# EAGLE schematic AutoTunerV1 (EAGLE 9.6.2)

## Sheet 1 of 4: mcu
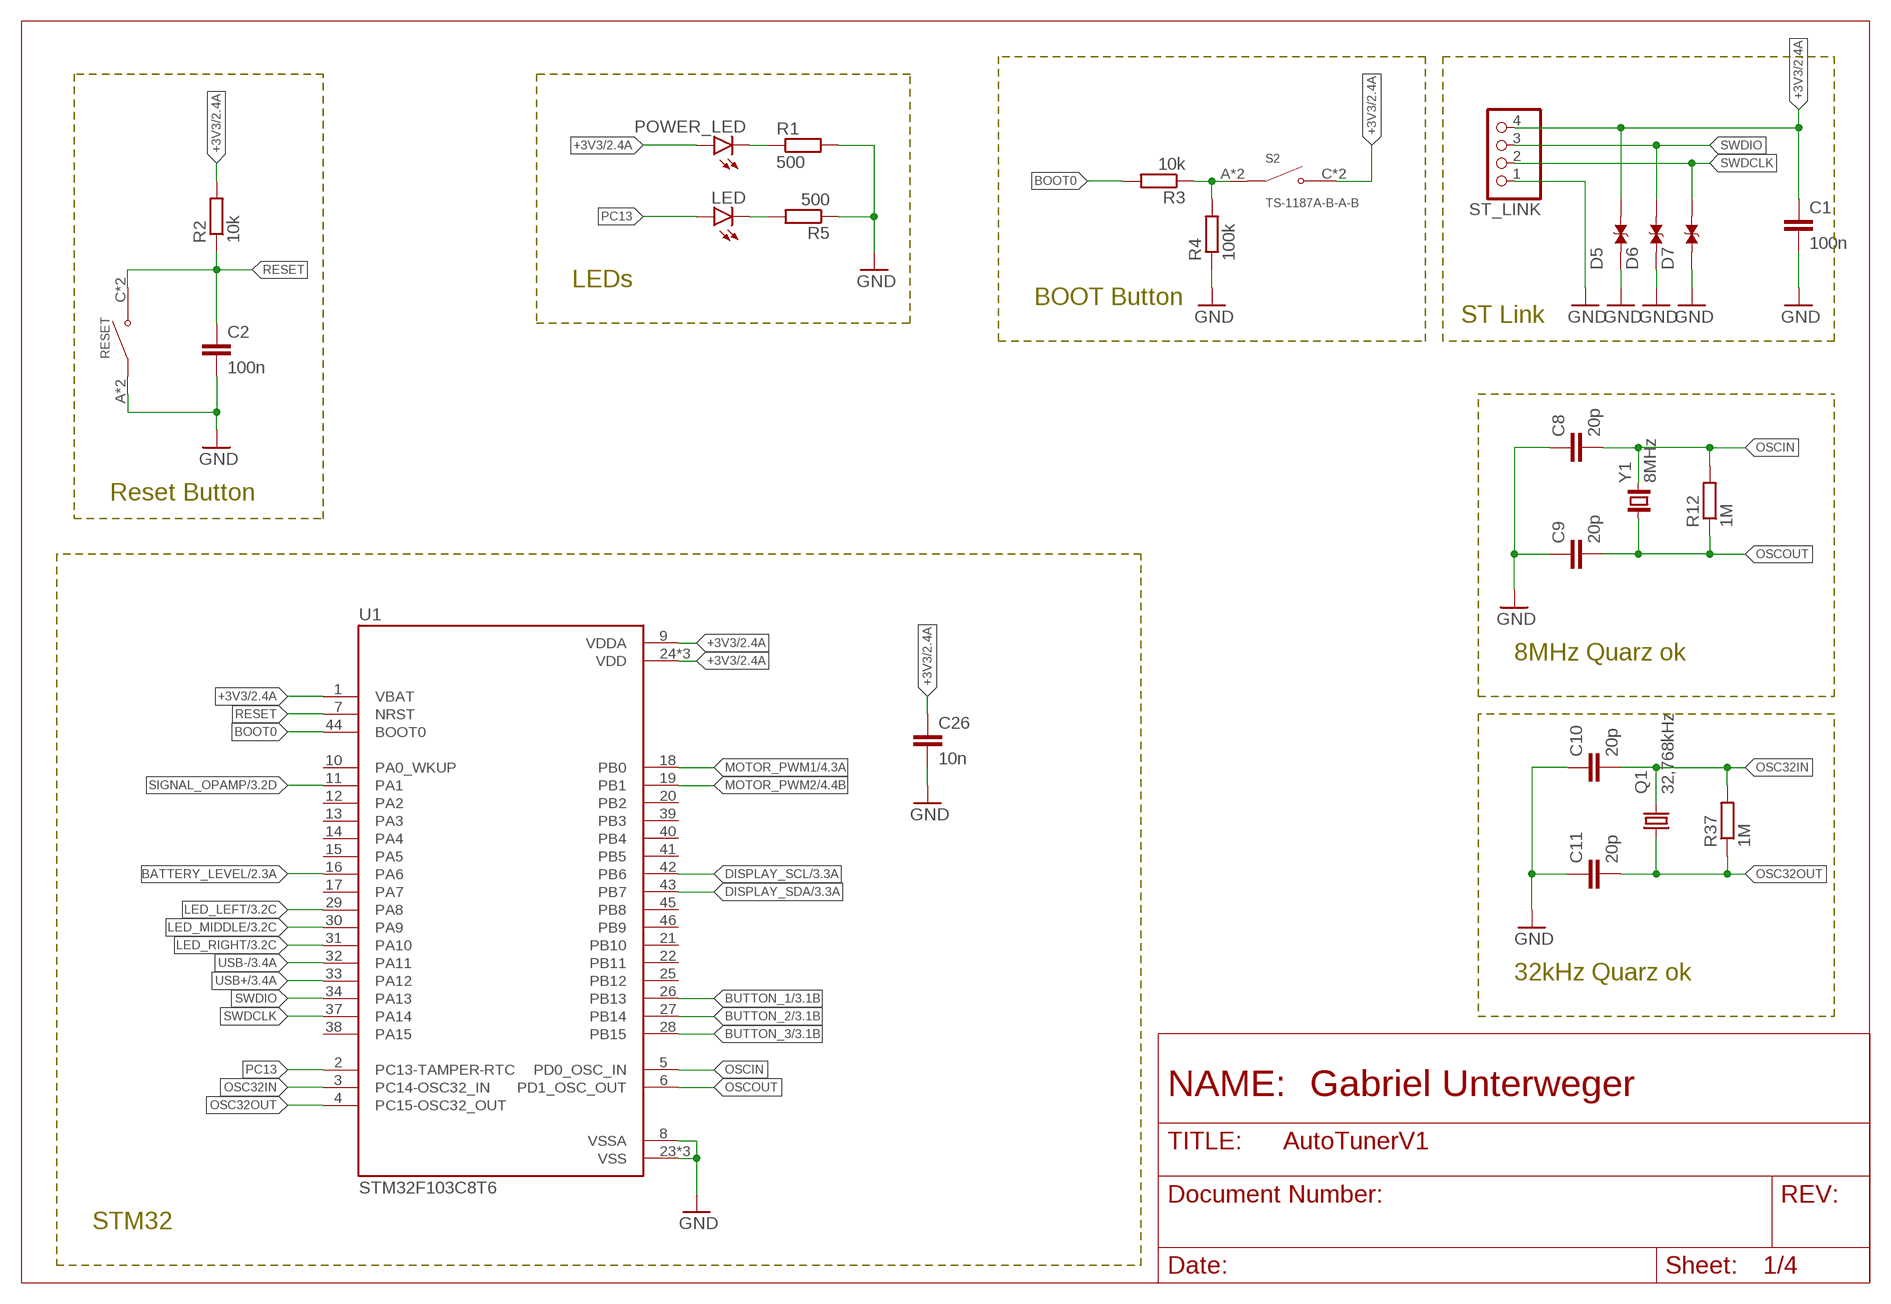
[diagram p0: schematic, sheet 1]

### Parts
C1  100n  C-EUC0805  [C0805]
C2  100n  C-EUC0805  [C0805]
C8  20p  C-EUC0805  [C0805]
C9  20p  C-EUC0805  [C0805]
C10  20p  C-EUC0805  [C0805]
C11  20p  C-EUC0805  [C0805]
C26  10n  C-EUC0805  [C0805]
D5  TESD5V0L1UC_RJG  [DIO_TESD5V0L1UC_RJG]
D6  TESD5V0L1UC_RJG  [DIO_TESD5V0L1UC_RJG]
D7  TESD5V0L1UC_RJG  [DIO_TESD5V0L1UC_RJG]
LED  LEDCHIPLED_0805  [CHIPLED_0805]
POWER_LED  LEDCHIPLED_0805  [CHIPLED_0805]
Q1  32,768kHz  KX-327-NHF  [3.2X1.5]
R1  500  R-EU_R0805  [R0805]
R2  10k  R-EU_R0805  [R0805]
R3  10k  R-EU_R0805  [R0805]
R4  100k  R-EU_R0805  [R0805]
R5  500  R-EU_R0805  [R0805]
R12  1M  R-EU_R0805  [R0805]
R37  1M  R-EU_R0805  [R0805]
RESET  TS-1187A-B-A-B  [SW_TS-1187A-B-A-B]
S2  TS-1187A-B-A-B  [SW_TS-1187A-B-A-B]
ST_LINK  PINHD-1X4  [1X04]
U1  STM32F103C8T6  [QFP50P900X900X160-48N]
Y1  8MHz  CRYSTAL_NX5032GA  [CRYSTAL_2-SMD-5X3]

### Nets
+3V3: C1.1 C26.1 D5.2 POWER_LED.A R2.2 S2.C(NO) S2.D(NO) ST_LINK.4 U1.1(VBAT) U1.9(VDDA) U1.24(VDD) U1.36(VDD) U1.48(VDD) ; also sheet 2,3,4
BATTERY_LEVEL: U1.16(PA6) ; also sheet 2
BOOT0: R3.2 U1.44(BOOT0)
BUTTON_1: U1.26(PB13) ; also sheet 3
BUTTON_2: U1.27(PB14) ; also sheet 3
BUTTON_3: U1.28(PB15) ; also sheet 3
DISPLAY_SCL: U1.42(PB6) ; also sheet 3
DISPLAY_SDA: U1.43(PB7) ; also sheet 3
GND: C1.2 C2.2 C8.1 C9.1 C10.1 C11.1 C26.2 D5.1 D6.1 D7.1 R1.2 R4.1 R5.1 RESET.A(COM) RESET.B(COM) ST_LINK.1 U1.8(VSSA) U1.23(VSS) U1.35(VSS) U1.47(VSS) ; also sheet 2,3,4
LED_LEFT: U1.29(PA8) ; also sheet 3
LED_MIDDLE: U1.30(PA9) ; also sheet 3
LED_RIGHT: U1.31(PA10) ; also sheet 3
MOTOR_PWM1: U1.18(PB0) ; also sheet 4
MOTOR_PWM2: U1.19(PB1) ; also sheet 4
N$2: LED.C R5.2
N$3: POWER_LED.C R1.1
N$5: R3.1 R4.2 S2.A(COM) S2.B(COM)
OSC32IN: C10.2 Q1.2 R37.2 U1.3(PC14-OSC32_IN)
OSC32OUT: C11.2 Q1.1 R37.1 U1.4(PC15-OSC32_OUT)
OSCIN: C8.2 R12.2 U1.5(PD0_OSC_IN) Y1.2
OSCOUT: C9.2 R12.1 U1.6(PD1_OSC_OUT) Y1.1
PC13: LED.A U1.2(PC13-TAMPER-RTC)
RESET: C2.1 R2.1 RESET.C(NO) RESET.D(NO) U1.7(NRST)
SIGNAL_OPAMP: U1.11(PA1) ; also sheet 3,4
SWDCLK: D7.2 ST_LINK.2 U1.37(PA14)
SWDIO: D6.2 ST_LINK.3 U1.34(PA13)
USB+: U1.33(PA12) ; also sheet 3
USB-: U1.32(PA11) ; also sheet 3
Unconnected: U1.10(PA0_WKUP) U1.12(PA2) U1.13(PA3) U1.14(PA4) U1.15(PA5) U1.17(PA7) U1.20(PB2) U1.21(PB10) U1.22(PB11) U1.25(PB12) U1.38(PA15) U1.39(PB3) U1.40(PB4) U1.41(PB5) U1.45(PB8) U1.46(PB9)

### Notes on the sheet
- LEDs
- BOOT Button
- ST Link
- Reset Button
- 8MHz Quarz ok
- 32kHz Quarz ok
- STM32

## Sheet 2 of 4: battery / voltage converter
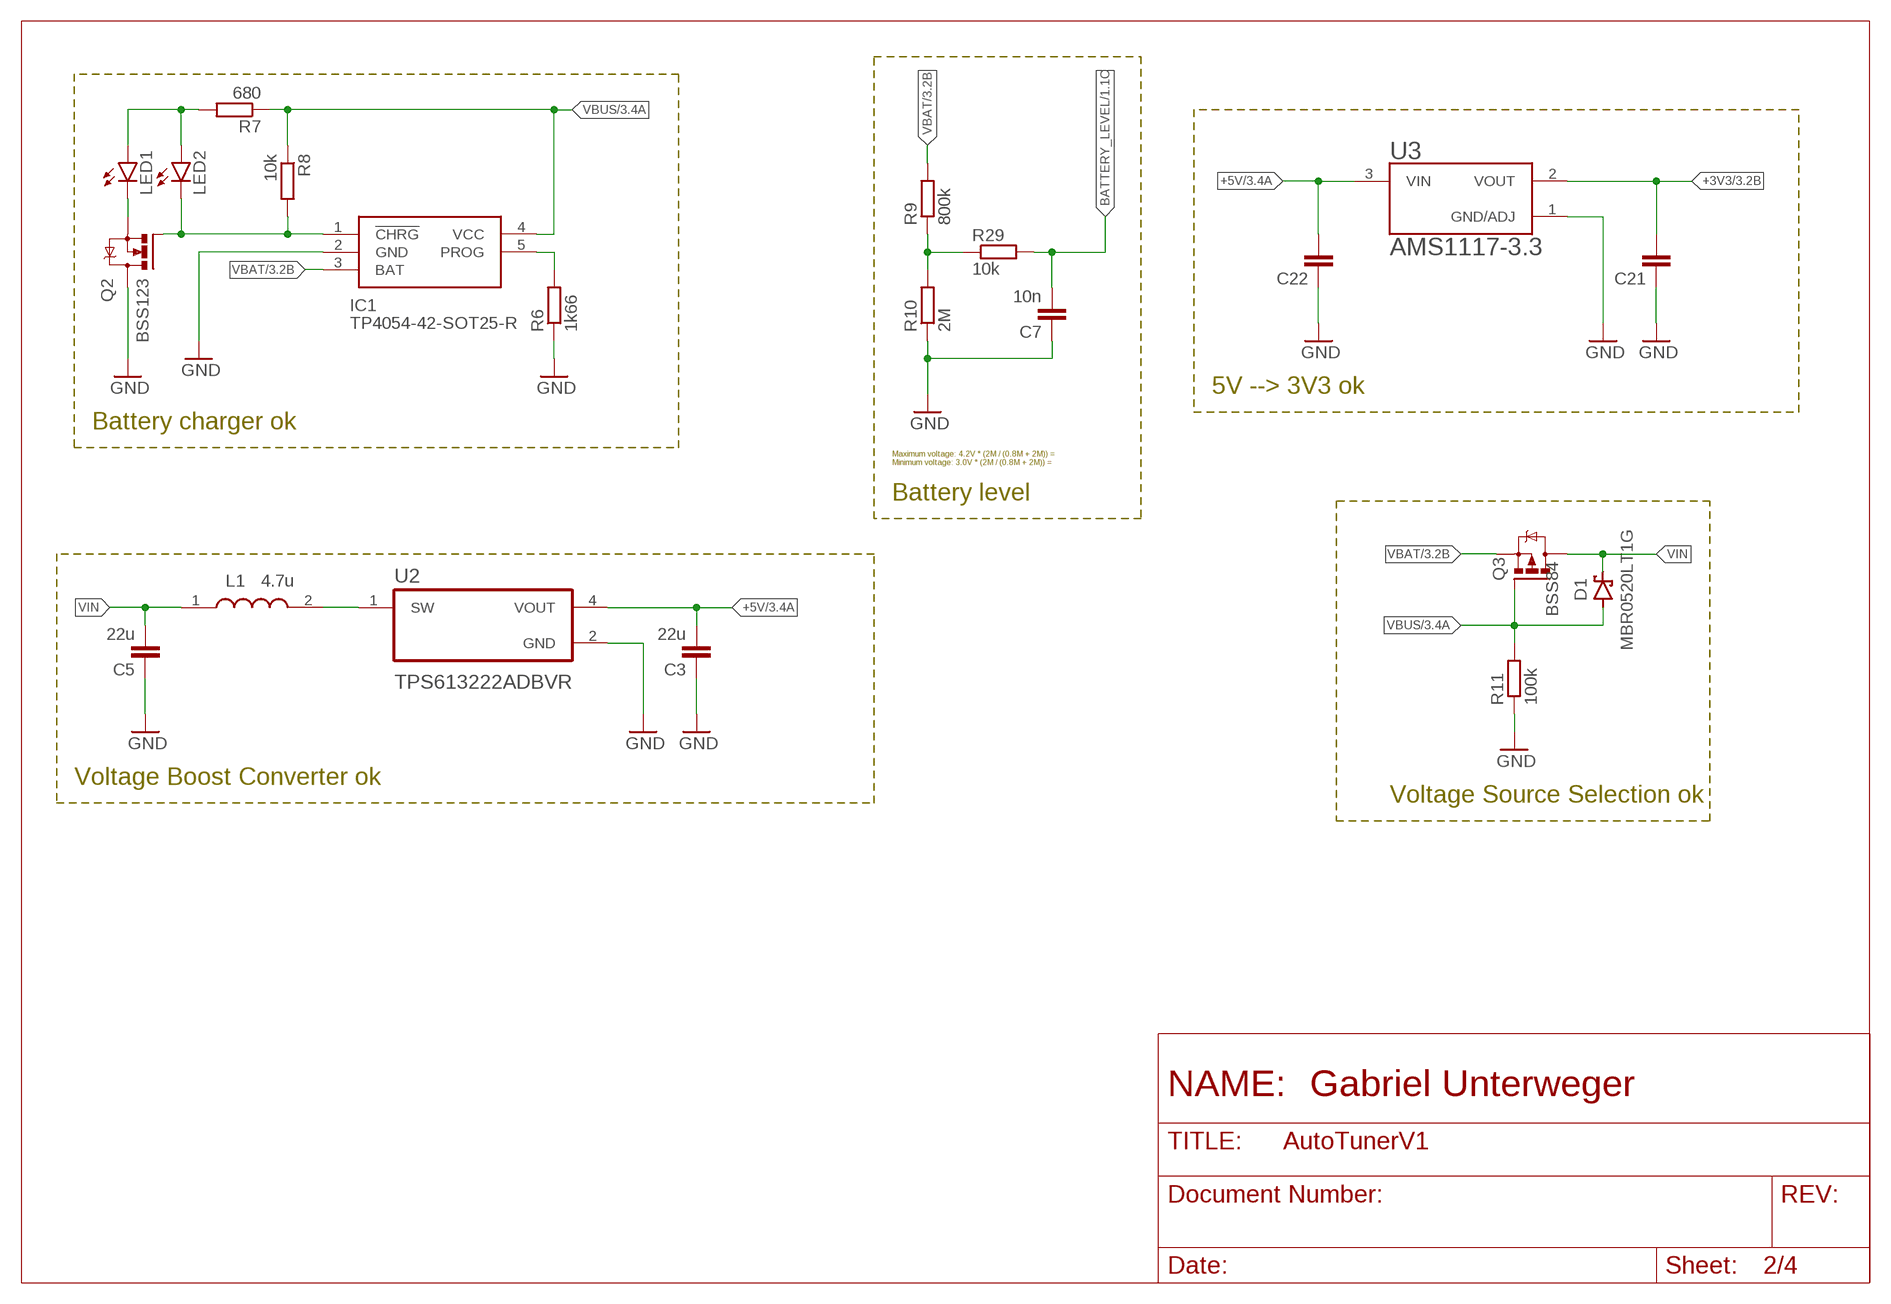
[diagram p1: schematic, sheet 2]

### Parts
C3  22u  C-EUC0805  [C0805]
C5  22u  C-EUC0805  [C0805]
C7  10n  C-EUC0805  [C0805]
C21  C-EUC0805  [C0805]
C22  C-EUC0805  [C0805]
D1  MBR0520LT1G  SCHOTTKY_MBR0520LT1GDO-219  [SODFL3718X115]
IC1  TP4054-42-SOT25-R  [SOT95P280X100-5N]
L1  4.7u  DFE252012P-4R7M=P2  [DFE2HCAH1R0MJ0L]
LED1  LEDCHIPLED_0805  [CHIPLED_0805]
LED2  LEDCHIPLED_0805  [CHIPLED_0805]
Q2  BSS123  NMOSFET_BSS123_SOT23-GSD  [SOT23]
Q3  BSS84  PMOSFET_BSS84_SOT23-GSD  [SOT23]
R6  1k66  R-EU_R0805  [R0805]
R7  680  R-EU_R0805  [R0805]
R8  10k  R-EU_R0805  [R0805]
R9  800k  R-EU_R0805  [R0805]
R10  2M  R-EU_R0805  [R0805]
R11  100k  R-EU_R0805  [R0805]
R29  10k  R-EU_R0805  [R0805]
U2  TPS613222ADBVR  [SOT95P280X145-5N]
U3  AMS1117-3.3  [SOT229P700X180-4N]

### Nets
+3V3: C21.2 U3.2(VOUT) ; also sheet 1,3,4
+5V: C3.2 C22.2 U2.4(VOUT) U3.3(VIN) ; also sheet 3
BATTERY_LEVEL: C7.2 R29.2 ; also sheet 1
GND: C3.1 C5.1 C7.1 C21.1 C22.1 IC1.2(GND) Q2.3(D) R6.1 R10.1 R11.1 U2.2(GND) U3.1(GND/ADJ) ; also sheet 1,3,4
N$1: L1.2 U2.1(SW)
N$4: R9.1 R10.2 R29.1
N$8: IC1.5(PROG) R6.2
N$9: IC1.1(!CHRG) LED2.C Q2.1(G) R8.2
N$11: LED1.A LED2.A R7.2
N$12: LED1.C Q2.2(S)
VBAT: IC1.3(BAT) Q3.2(S) R9.2 ; also sheet 3,4
VBUS: D1.2(A) IC1.4(VCC) Q3.1(G) R7.1 R8.1 R11.2 ; also sheet 3
VIN: C5.2 D1.1(C) L1.1 Q3.3(D)

### Notes on the sheet
- 5V --> 3V3 ok
- Battery charger ok
- Maximum voltage: 4.2V * (2M / (0.8M + 2M)) =
  Minimum voltage: 3.0V * (2M / (0.8M + 2M)) =
- Battery level
- Voltage Boost Converter ok
- Voltage Source Selection ok

## Sheet 3 of 4: I/O
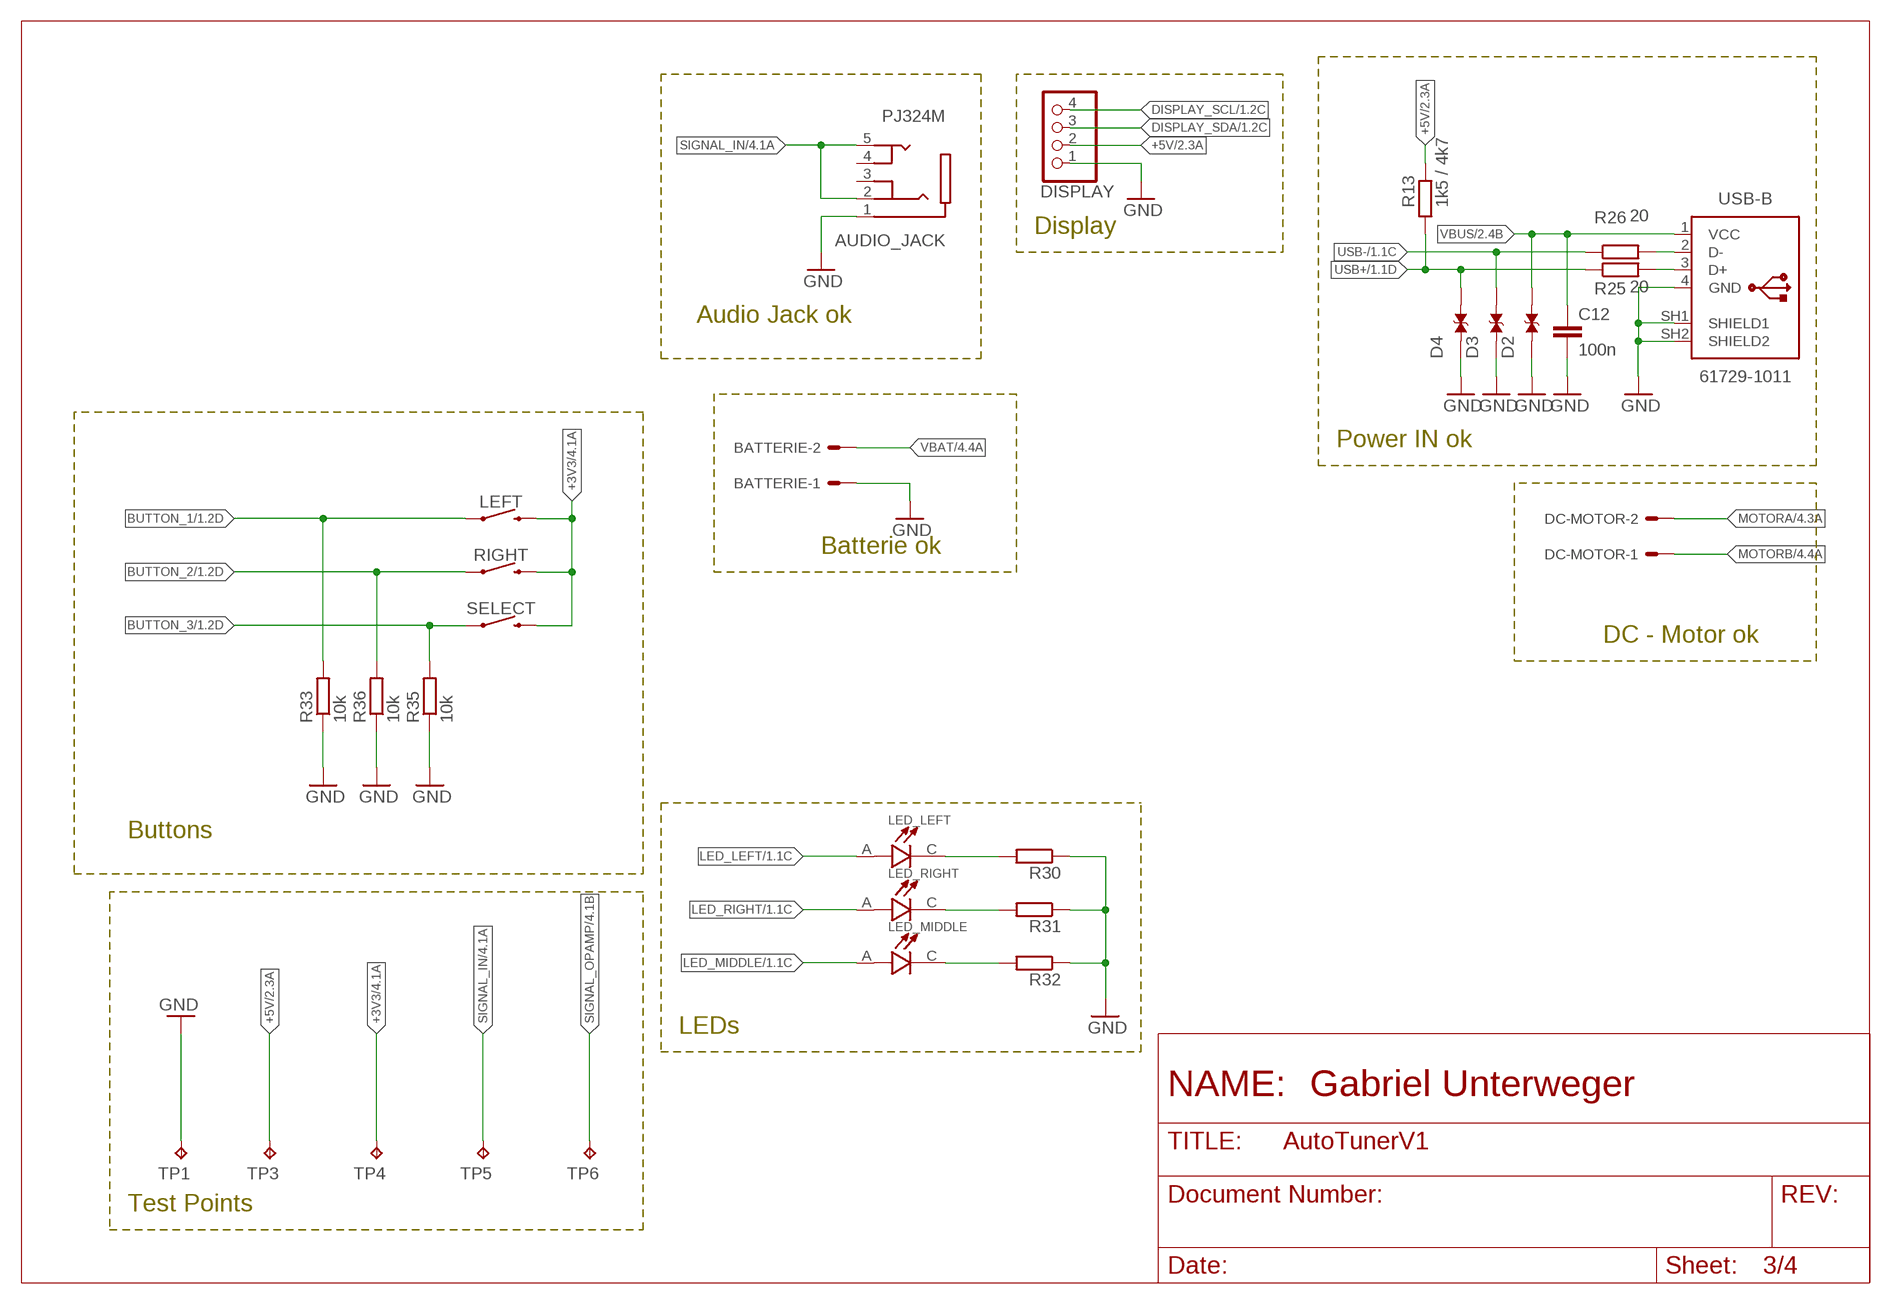
[diagram p2: schematic, sheet 3]

### Parts
AUDIO_JACK  PJ324M  [WENZHOU_PJ324M]
BATTERIE  22-27-2021-02  [6410-02]
C12  100n  C-EUC0805  [C0805]
D2  TESD5V0L1UC_RJG  [DIO_TESD5V0L1UC_RJG]
D3  TESD5V0L1UC_RJG  [DIO_TESD5V0L1UC_RJG]
D4  TESD5V0L1UC_RJG  [DIO_TESD5V0L1UC_RJG]
DC-MOTOR  22-27-2021-02  [6410-02]
DISPLAY  PINHD-1X4  [1X04]
LED_LEFT  L-53GD  [LEDRD254W50D500H1060]
LED_MIDDLE  L-53GD  [LEDRD254W50D500H1060]
LED_RIGHT  L-53GD  [LEDRD254W50D500H1060]
LEFT  MOMENTARY-SWITCH-SPST-PTH-12MM  [TACTILE_SWITCH_PTH_12MM]
R13  1k5 / 4k7  R-EU_R0805  [R0805]
R25  20  R-EU_R0805  [R0805]
R26  20  R-EU_R0805  [R0805]
R30  R-EU_R0805  [R0805]
R31  R-EU_R0805  [R0805]
R32  R-EU_R0805  [R0805]
R33  10k  R-EU_R0805  [R0805]
R35  10k  R-EU_R0805  [R0805]
R36  10k  R-EU_R0805  [R0805]
RIGHT  MOMENTARY-SWITCH-SPST-PTH-12MM  [TACTILE_SWITCH_PTH_12MM]
SELECT  MOMENTARY-SWITCH-SPST-PTH-12MM  [TACTILE_SWITCH_PTH_12MM]
TP1  TPB1,27  [B1,27]
TP3  TPB1,27  [B1,27]
TP4  TPB1,27  [B1,27]
TP5  TPB1,27  [B1,27]
TP6  TPB1,27  [B1,27]
USB-B  61729-1011  [61729-1011BLF]

### Nets
+3V3: LEFT.3 RIGHT.3 SELECT.3 TP4.TP ; also sheet 1,2,4
+5V: DISPLAY.2 R13.2 TP3.TP ; also sheet 2
BUTTON_1: LEFT.1 R33.2 ; also sheet 1
BUTTON_2: R36.2 RIGHT.1 ; also sheet 1
BUTTON_3: R35.2 SELECT.1 ; also sheet 1
DISPLAY_SCL: DISPLAY.4 ; also sheet 1
DISPLAY_SDA: DISPLAY.3 ; also sheet 1
GND: AUDIO_JACK.1(SLEEVE) BATTERIE.1 C12.2 D2.1 D3.1 D4.1 DISPLAY.1 R30.1 R31.1 R32.1 R33.1 R35.1 R36.1 TP1.TP USB-B.4(GND) USB-B.SH1(SHIELD1) USB-B.SH2(SHIELD2) ; also sheet 1,2,4
LED_LEFT: LED_LEFT.A ; also sheet 1
LED_MIDDLE: LED_MIDDLE.A ; also sheet 1
LED_RIGHT: LED_RIGHT.A ; also sheet 1
MOTORA: DC-MOTOR.2 ; also sheet 4
MOTORB: DC-MOTOR.1 ; also sheet 4
N$19: LED_LEFT.C R30.2
N$20: LED_RIGHT.C R31.2
N$23: LED_MIDDLE.C R32.2
N$29: R25.2 USB-B.3(D+)
N$30: R26.2 USB-B.2(D-)
SIGNAL_IN: AUDIO_JACK.2(RING_1) AUDIO_JACK.5(TIP_2) TP5.TP ; also sheet 4
SIGNAL_OPAMP: TP6.TP ; also sheet 1,4
USB+: D4.2 R13.1 R25.1 ; also sheet 1
USB-: D3.2 R26.1 ; also sheet 1
VBAT: BATTERIE.2 ; also sheet 2,4
VBUS: C12.1 D2.2 USB-B.1(VCC) ; also sheet 2
Unconnected: AUDIO_JACK.3(RING_2) AUDIO_JACK.4(TIP_1)

### Notes on the sheet
- Display
- Audio Jack ok
- Power IN ok
- Batterie ok
- DC - Motor ok
- Buttons
- LEDs
- Test Points

## Sheet 4 of 4: Motor Steuerung / Signal Verarbeitung
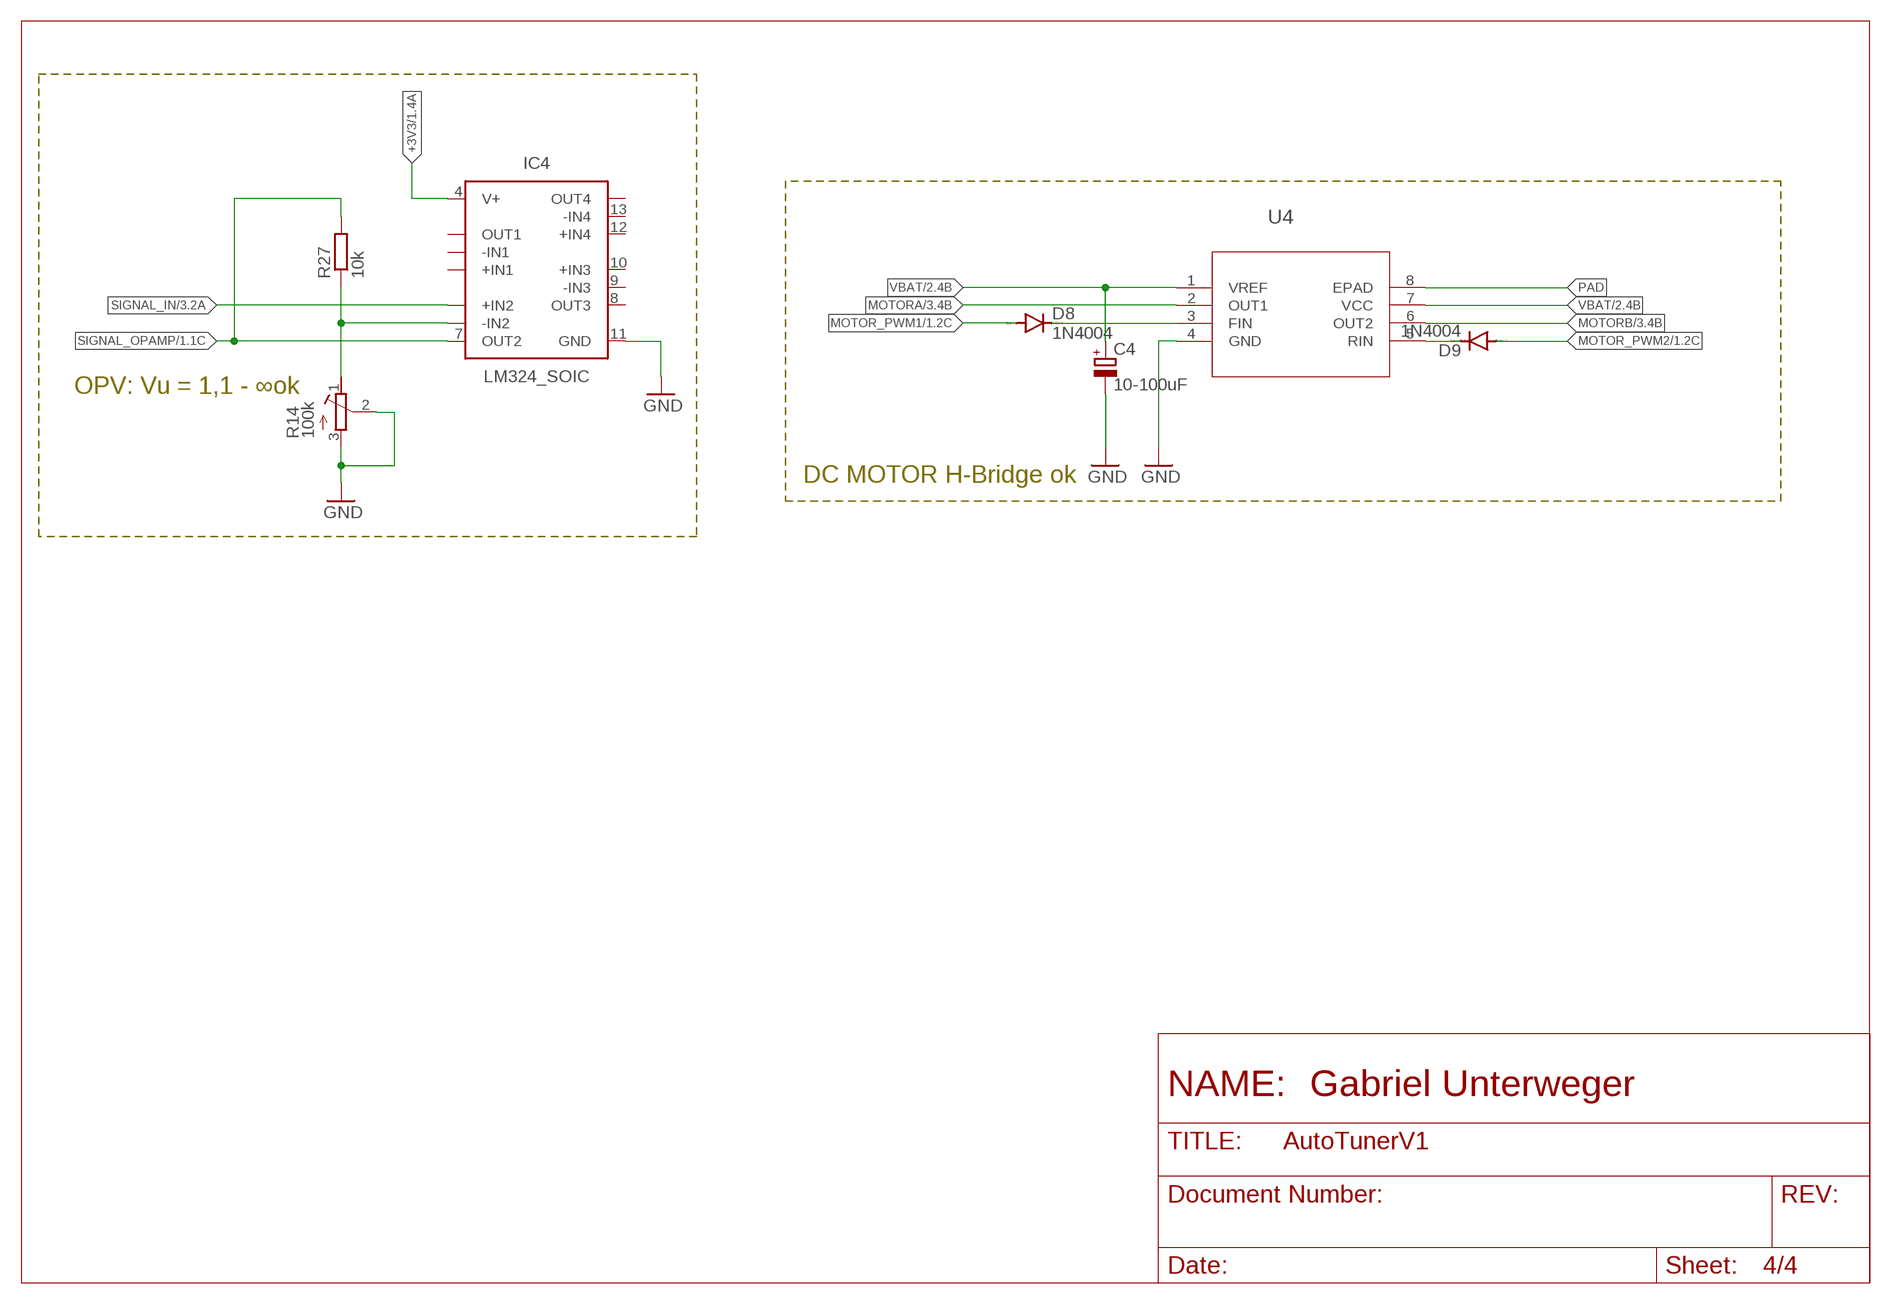
[diagram p3: schematic, sheet 4]

### Parts
C4  10-100uF  CPOL-EUB45181A  [B45181A]
D8  1N4004  [DO41-10]
D9  1N4004  [DO41-10]
IC4  LM324_SOIC  [SOIC127P600X175-14N]
R14  100k  R-TRIMM43P  [RTRIM43P]
R27  10k  R-EU_R0805  [R0805]
U4  BD6222HFP-TRHRP7_ROM-M  [HRP7_ROM-M]

### Nets
+3V3: IC4.4(V+) ; also sheet 1,2,3
GND: C4.- IC4.11(GND) R14.2(S) R14.3(A) U4.4(GND) ; also sheet 1,2,3
MOTOR_PWM1: D8.A ; also sheet 1
MOTOR_PWM2: D9.A ; also sheet 1
MOTORA: U4.2(OUT1) ; also sheet 3
MOTORB: U4.6(OUT2) ; also sheet 3
N$6: D8.C U4.3(FIN)
N$7: U4.7(VCC)
N$14: D9.C U4.5(RIN)
N$16: IC4.6(-IN2) R14.1(E) R27.1
PAD: U4.8(EPAD)
SIGNAL_IN: IC4.5(+IN2) ; also sheet 3
SIGNAL_OPAMP: IC4.7(OUT2) R27.2 ; also sheet 1,3
VBAT: C4.+ U4.1(VREF) ; also sheet 2,3
Unconnected: IC4.1(OUT1) IC4.2(-IN1) IC4.3(+IN1) IC4.8(OUT3) IC4.9(-IN3) IC4.10(+IN3) IC4.12(+IN4) IC4.13(-IN4) IC4.14(OUT4)

### Notes on the sheet
- OPV: Vu = 1,1 - ∞ok
- DC MOTOR H-Bridge ok

## Library data of the parts
AUDIO_JACK = PJ324M:PJ324M: Headphone Stereo jack/Audio connector Check availability <https://pricing.snapeda.com/parts/PJ324M/Wenzhou%20QingPu%20Electronics%20Co.Ltd/view-part?ref=eda>; AVAILABILITY: Not in stock; CHECK_PRICES: https://www.snapeda.com/parts/PJ324M/Wenzhou+QingPu+Electronics+Co.Ltd/view-part/?ref=eda; DESCRIPTION: Headphone Stereo jack/Audio connector; MF: Wenzhou QingPu Electronics Co.Ltd; MP: PJ324M; PACKAGE: Package; PRICE: None; SNAPEDA_LINK: https://www.snapeda.com/parts/PJ324M/Wenzhou+QingPu+Electronics+Co.Ltd/view-part/?ref=snap
BATTERIE DC-MOTOR = con-molex:22-?-02: CONNECTOR wire to board 2.54 mm (.1 inch) pitch header; MF: MOLEX; OC_FARNELL: unknown; OC_NEWARK: unknown
C1-C3 C5 C7-C12 C21 C22 C26 = rcl:C-EU: CAPACITOR, European symbol; SPICEPREFIX: C
C4 = rcl:CPOL-EU: POLARIZED CAPACITOR, European symbol; SPICEPREFIX: C
D1 = Diode:SCHOTTKY_: Schottky Diode - Popular parts; CATEGORY: Diode; DESCRIPTION: DIODE SCHOTTKY 20V 500MA SOD123; LCSC_PART: C191023; MANUFACTURER: ON Semiconductor; MPN: MBR0520LT1G; SUB-CATEGORY: Schottky
D2-D7 = TESD5V0L1UC_RJG:TESD5V0L1UC_RJG: Check availability <https://pricing.snapeda.com/parts/TESD5V0L1UC%20RJG/Taiwan%20Semiconductor%20Corporation/view-part?ref=eda>; AVAILABILITY: In Stock; CHECK_PRICES: https://www.snapeda.com/parts/TESD5V0L1UC%20RJG/Taiwan+Semiconductor/view-part/?ref=eda; DESCRIPTION: DFN1006L, 5V, 100W, 2pF, ESD Protection Diode & Array; LCSC_PART: C7420372; MF: Taiwan Semiconductor Corporation; MP: TESD5V0L1UC RJG; PACKAGE: DFN1006L Taiwan Semiconductor; PRICE: None; PURCHASE-URL: https://www.snapeda.com/api/url_track_click_mouser/?unipart_id=3789592&manufacturer=Taiwan Semiconductor Corporation&part_name=TESD5V0L1UC RJG&search_term=protection diode; SNAPEDA_LINK: https://www.snapeda.com/parts/TESD5V0L1UC%20RJG/Taiwan+Semiconductor/view-part/?ref=snap
D8 D9 = diode:1N4004: DIODE general purpose rectifier, 1 A
DISPLAY ST_LINK = pinhead:PINHD-1X4: PIN HEADER
IC1 = TP4054-42-SOT25-R:TP4054-42-SOT25-R: Standalone Linear Li-ion Battery Charger with Thermal Regulation, SOT-23-5 Source: Datasheet <http://images.100y.com.tw/pdf_file/38-TP-TP4054x.pdf>; DESCRIPTION: Standalone Linear Li-ion Battery Charger with Thermal Regulation, SOT-23-5; HEIGHT: 1mm; LCSC_PART: C32574; MANUFACTURER_NAME: TOP POWER; MANUFACTURER_PART_NUMBER: TP4054-42-SOT25-R
IC4 = IC_Linear:LM324: Quad-Operational Amplifiers Reference Datasheet <https://www.ti.com/lit/ds/snosc16d/snosc16d.pdf>; CATEGORY: Operational Amplifiers; DESCRIPTION: Quad-Operational Amplifiers; LCSC_PART: C71035; MANUFACTURER: Generic; MPN: Generic; SERIES: LM324; SUB-CATEGORY: Amplifier ICs; TYPE: Op Amps - Operational Amplifiers
L1 = DFE252012P-4R7M=P2:DFE252012P-4R7M=P2: Toko DFE252012P Series Shielded Wire-wound SMD Inductor with a Powered Iron Core, 4.7 uH Wire-Wound 2.2A Idc Source: Datasheet <https://psearch.en.murata.com/inductor/product/DFE252012P-4R7M#.html>; ARROW_PART_NUMBER: DFE252012P-4R7M=P2; ARROW_PRICE-STOCK: https://www.arrow.com/en/products/dfe252012p-4r7mp2/murata-manufacturing?region=europe; DESCRIPTION: Toko DFE252012P Series Shielded Wire-wound SMD Inductor with a Powered Iron Core, 4.7 uH Wire-Wound 2.2A Idc; HEIGHT: 1.2mm; LCSC_PART: C391306; MANUFACTURER_NAME: Murata Electronics; MANUFACTURER_PART_NUMBER: DFE252012P-4R7M=P2; MOUSER_PART_NUMBER: 81-DFE252012P-4R7MP2; MOUSER_PRICE-STOCK: https://www.mouser.co.uk/ProductDetail/Murata-Electronics/DFE252012P-4R7M%3dP2?qs=KuGPmAKtFKVp8Hnp6vDIBg%3D%3D
LED LED1 LED2 POWER_LED = led:LED: LED OSRAM: - CHIPLED LG R971, LG N971, LY N971, LG Q971, LY Q971, LO R971, LY R971 LH N974, LH R974 LS Q976, LO Q976, LY Q976 LO Q996 - Hyper CHIPLED LW Q18S LB Q993, LB Q99A, LB R99A - SideLED LS A670, LO A670, LY A670, LG A670, LP A670 LB A673, LV A673, LT A673, LW A673 LH A674 LY A675 LS A676, LA A676, LO A676, LY A676, LW A676 LS A679, LY A679, LG A679 - Hyper Micro SIDELED® LS Y876, LA Y876, LO Y876, LY Y876 LT Y87S - SmartLED LW L88C, LW L88S LB L89C, LB L89S, LG L890 LS L89K, LO L89K, LY L89K LS L896, LA L896, LO L896, LY L896 - TOPLED LS T670, LO T670, LY T670, LG T670, LP T670 LSG T670, LSP T670, LSY T670, LOP T670, LYG T670 LG T671, LOG T671, LSG T671 LB T673, LV T673, LT T673, LW T673 LH T674 LS T676, LA T676, LO T676, LY T676, LB T676, LH T676, LSB T676, LW T676 LB T67C, LV T67C, LT T67C, LS T67K, LO T67K, LY T67K, LW E67C LS E67B, LA E67B, LO E67B, LY E67B, LB E67C, LV E67C, LT E67C LW T67C LS T679, LY T679, LG T679 LS T770, LO T770, LY T770, LG T770, LP T770 LB T773, LV T773, LT T773, LW T773 LH T774 LS E675, LA E675, LY E675, LS T675 LS T776, LA T776, LO T776, LY T776, LB T776 LHGB T686 LT T68C, LB T68C - Hyper Mini TOPLED® LB M676 - Mini TOPLED Santana® LG M470 LS M47K, LO M47K, LY M47K Source: http://www.osram.convergy.de LUXEON: - LUMILED® LXK2-PW12-R00, LXK2-PW12-S00, LXK2-PW14-U00, LXK2-PW14-V00 LXK2-PM12-R00, LXK2-PM12-S00, LXK2-PM14-U00 LXK2-PE12-Q00, LXK2-PE12-R00, LXK2-PE12-S00, LXK2-PE14-T00, LXK2-PE14-U00 LXK2-PB12-K00, LXK2-PB12-L00, LXK2-PB12-M00, LXK2-PB14-N00, LXK2-PB14-P00, LXK2-PB14-Q00 LXK2-PR12-L00, LXK2-PR12-M00, LXK2-PR14-Q00, LXK2-PR14-R00 LXK2-PD12-Q00, LXK2-PD12-R00, LXK2-PD12-S00 LXK2-PH12-R00, LXK2-PH12-S00 LXK2-PL12-P00, LXK2-PL12-Q00, LXK2-PL12-R00 Source: www.luxeon.com KINGBRIGHT: KA-3528ASYC Source: www.kingbright.com
LED_LEFT LED_MIDDLE LED_RIGHT = L-53GD:L-53GD: LED; 5mm; green; 5-32mcd; 60°; Front: convex Check availability <https://pricing.snapeda.com/parts/L-53GD/Kingbright/view-part?ref=eda>; AVAILABILITY: In Stock; CHECK_PRICES: https://www.snapeda.com/parts/L-53GD/Kingbright/view-part/?ref=eda; DESCRIPTION: LED; 5mm; green; 5-32mcd; 60°; Front: convex; MF: Kingbright; MP: L-53GD; PACKAGE: CDIP-28 Kingbright; PRICE: None; PURCHASE-URL: https://www.snapeda.com/api/url_track_click_mouser/?unipart_id=525636&manufacturer=Kingbright&part_name=L-53GD&search_term=led, 5mm; SNAPEDA_LINK: https://www.snapeda.com/parts/L-53GD/Kingbright/view-part/?ref=snap
LEFT RIGHT SELECT = SparkFun-Switches:MOMENTARY-SWITCH-SPST: Momentary Switch (Pushbutton) - SPST Normally-open (NO) SPST momentary switches (buttons, pushbuttons). Variants PTH-12MM - 12mm square, through-hole Momentary Pushbutton Switch - 12mm Square <https://www.sparkfun.com/products/9190> (COM-09190) PTH-6.0MM, PTH-6.0MM-KIT - 6.0mm square, through-hole Mini Pushbutton Switch <https://www.sparkfun.com/products/97> (COM-00097) KIT package intended for soldering kit's - only one side of pads' copper is exposed. PTH-RIGHT-ANGLE-KIT - Right-angle, through-hole Right Angle Tactile Button <https://www.sparkfun.com/products/10791> - Used on SparkFun BigTime Watch Kit <https://www.sparkfun.com/products/11734> SMD-12MM - 12mm square, surface-mount Tactile Button - SMD (12mm) <https://www.sparkfun.com/products/12993> (COM-12993) Used on SparkFun PicoBoard <https://www.sparkfun.com/products/11888> SMD-4.5MM - 4.5mm Square Trackball Switch Used on SparkFun Blackberry Trackballer Breakout <https://www.sparkfun.com/products/13169> SMD-4.6MMX2.8MM - 4.60mm x 2.80mm, surface mount Used on SparkFun Pro Micro - RP2040 <https://www.sparkfun.com/products/17717> SMD-5.2MM, SMD-5.2-REDUNDANT - 5.2mm square, surface-mount Mini Pushbutton Switch - SMD <https://www.sparkfun.com/products/8720> (COM-08720) Used on Arduino Pro Mini <https://www.sparkfun.com/products/11114> REDUNDANT package connects both switch circuits together SMD-6.0X3.5MM - 6.0 x 3.5mm, surface mount Momentary Reset Switch SMD <https://www.sparkfun.com/products/8229> (COM-08229) SMD-6.2MM-TALL - 6.2mm square, surface mount Tactile Button - SMD (6mm) <https://www.sparkfun.com/products/12992> Used on SparkFun Digital Sandbox <https://www.sparkfun.com/products/12651> SMD-RIGHT-ANGLE - Right-angle, surface mount Used on SparkFun Block for Intel® Edison - Arduino <https://www.sparkfun.com/products/13036>; PROD_ID: SWCH-09185; SF_SKU: COM-09190
Q1 = crystal-geyer_V1_0:KX-327: Tuning Fork Crystals (kHz) SMD: KX327 - Serie Model Size l/w/h [mm] Frequency Range Frequency Stability Temp. Range [°C] Load Capacitance AECQ 200 availabel Datasheet KX-327VT KX-327FT KX-327RT KX-327NHT KX-327NHF KX-327L KX-327S 1.25/1.05/0.5 1.6/1.0/0.5 2.0/1.2/0.6 3.2/1.5/0.8 3.2/1.5/0.8 7.0/1.5/1.4 8.2/3.8/2.5 32,768 kHz 32,768 kHz 32,768 kHz 32,768 kHz 32,768 kHz 32,768 kHz 32,768 kHz ±10 … ±20ppm ±10 … ±20ppm ±10 … ±20ppm ±10 … ±20ppm ±10 … ±20ppm ±10 … ±20ppm ±5 … ±20ppm (*) -40°C …+85°C (*) -40°C …+85°C (*) -40°C …+85°C (*) -40°C …+85°C (*) -40°C …+125°C (*) -40°C …+85°C (*) -40°C …+85°C 7/9/12,5 7/9/12,5 7/9/12,6 7/9/12,5 9/12,5 7/9/12,5 6/12,5 - - - - yes - - KX-327VT.pdf <http://www.geyer-electronic.de/uploads/tx_userartikelfrequenz/GEYER-KX-327VT.pdf> KX-327FT.pdf <http://www.geyer-electronic.de/uploads/tx_userartikelfrequenz/GEYER-KX-327FT.pdf> KX-327RT.pdf <http://www.geyer-electronic.de/uploads/tx_userartikelfrequenz/GEYER-KX-327RT.pdf> KX-327NHT.pdf <http://www.geyer-electronic.de/uploads/tx_userartikelfrequenz/GEYER-KX-327NHT.pdf> KX-327NHF.pdf <http://www.geyer-electronic.de/uploads/tx_userartikelfrequenz/GEYER-KX-327NHF.pdf> KX-327L.pdf <http://www.geyer-electronic.de/uploads/tx_userartikelfrequenz/GEYER-KX-327L.pdf> KX-327S.pdf <http://www.geyer-electronic.de/uploads/tx_userartikelfrequenz/GEYER-KX-327S.pdf> <http://www.geyer-electronic.de/fileadmin/template/img/logo-geyer-electronic.png> Details see: http://www.geyer-electronic.de/Frequenz-Produkte.9.0.html Created 2016-06-07, Hans Locher 2016 (C) Geyer Quartz Technology KX327VT,KX327FT,KX327RT,KX327NHT,KX327NHF,KX327S,KX327L;125105;1610;2012;3215;7015;8238;1,25x1,05,1.25x1.05;1,6x1,0,1.6x1.0;2,0x1,2,2.0x1.2;3,2x1,5,3.2x1.5;8,2x3,8,8.2x3.8,7.0x1.5,7,0x1,532.768kHz; LCSC_PART: C32346
Q2 = Transistor:NMOSFET_: N-Channel MOSFET - Popular parts; CATEGORY: Transistor; DESCRIPTION: MOSFET N-CH 100V 0.17A SOT-23; DRAIN_CURRENT: 170mA; LCSC_PART: C20917; MANUFACTURER: ON Semiconductor; MPN: BSS123L; OPERATING_TEMP: -55°C ~ 150°C; PART_STATUS: Active; ROHS_COMPLIANT: Yes; SUB-CATEGORY: MOSFET; THERMALLOSS: 360mW; TYPE: N-Channel
Q3 = Transistor:PMOSFET_: P-Channel MOSFET - Popular parts; CATEGORY: Transistor; DESCRIPTION: MOSFET P-CH 50V 130MA SOT-23; DRAIN_CURRENT: 130mA; LCSC_PARTS: C10487; MANUFACTURER: ON Semiconductor; MPN: BSS84; OPERATING_TEMP: -55°C ~ 150°C; PART_STATUS: Active; ROHS_COMPLIANT: Yes; SUB-CATEGORY: MOSFET; THERMALLOSS: 360mW; TYPE: P-Channel
R1-R13 R25-R27 R29-R33 R35-R37 = rcl:R-EU_: RESISTOR, European symbol; SPICEPREFIX: R
R14 = rcl:R-TRIMM: Trimm resistor; SPICEMODEL: X; SPICEPREFIXL: POT
RESET S2 = TS-1187A-B-A-B:TS-1187A-B-A-B: SPST 50mA @ 12VDC Top Actuated Round Button 160gf SMD Tactile Switches RoHS Check availability <https://pricing.snapeda.com/parts/TS-1187A-B-A-B/XKB%20Industrial%20Precision/view-part?ref=eda>; AVAILABILITY: Not in stock; DESCRIPTION: TS-1187A-B-A-B XKB Connectivity; LCSC_PART: C318884; MF: XKB Industrial Precision; MP: TS-1187A-B-A-B; PACKAGE: Package; PRICE: None
TP1 TP3-TP6 = testpad:TP: Test pad
U1 = STM32F103C8T6:STM32F103C8T6: Mainstream Performance line, ARM Cortex-M3 MCU with 64 Kbytes Flash, 72 MHz CPU, motor control, USB and CAN Check availability <https://pricing.snapeda.com/parts/STM32F103C8T6/STMicroelectronics/view-part?ref=eda>; AVAILABILITY: In Stock; CHECK_PRICES: https://www.snapeda.com/parts/STM32F103C8T6/STMicroelectronics/view-part/?ref=eda; DESCRIPTION: ARM® Cortex®-M3 STM32F1 Microcontroller IC 32-Bit 72MHz 64KB (64K x 8) FLASH 48-LQFP (7x7); LCSC_PART: C8734; MF: STMicroelectronics; MP: STM32F103C8T6; PACKAGE: LQFP-48 STMicroelectronics; PRICE: None; PURCHASE-URL: https://www.snapeda.com/api/url_track_click_mouser/?unipart_id=52195&manufacturer=STMicroelectronics&part_name=STM32F103C8T6&search_term=stm32f103c8t6; SNAPEDA_LINK: https://www.snapeda.com/parts/STM32F103C8T6/STMicroelectronics/view-part/?ref=snap
U2 = TPS613222ADBVR:TPS613222ADBVR: Check availability <https://pricing.snapeda.com/parts/TPS613222ADBVR/Texas%20Instruments/view-part?ref=eda>; AVAILABILITY: In Stock; CHECK_PRICES: https://www.snapeda.com/parts/TPS613222ADBVR/Texas+Instruments/view-part/?ref=eda; DESCRIPTION: 6-uA Quiescent Current, 1.8-A Switch Current Boost Converter; LCSC_PART: C2071163; MF: Texas Instruments; MP: TPS613222ADBVR; PACKAGE: SOT-23-5 Texas Instruments; PRICE: None; PURCHASE-URL: https://www.snapeda.com/api/url_track_click_mouser/?unipart_id=2771858&manufacturer=Texas Instruments&part_name=TPS613222ADBVR&search_term=tps613222a; SNAPEDA_LINK: https://www.snapeda.com/parts/TPS613222ADBVR/Texas+Instruments/view-part/?ref=snap
U3 = AMS1117-3.3:AMS1117-3.3: Check availability <https://pricing.snapeda.com/parts/AMS1117-3.3/Advanced%20Monolithic%20Systems/view-part?ref=eda>; AVAILABILITY: Not in stock; CHECK_PRICES: https://www.snapeda.com/parts/AMS1117-3.3/Advanced+Monolithic+Systems/view-part/?ref=eda; DESCRIPTION: Sot223/Pkg 1-Amp 3.3-Volt Low Drop Out Voltage Regulatator; LCSC_PART: C6186; MF: Advanced Monolithic Systems; MP: AMS1117-3.3; PACKAGE: SOT-223 Seeed Technology; PRICE: None; SNAPEDA_LINK: https://www.snapeda.com/parts/AMS1117-3.3/Advanced+Monolithic+Systems/view-part/?ref=snap
U4 = H-Brücke_BD622HFP-TR02:BD6222HFP-TR; COPYRIGHT: Copyright (C) 2022 Ultra Librarian. All rights reserved.; MANUFACTURER_PART_NUMBER: BD6222HFP-TR; MFR_NAME: ROHM Semiconductor
USB-B = Connector_USB:61729-1011: USB(2.0) Type-B, RCPT, 4POS, THT-R/A Datasheet <https://www.amphenol-icc.com/media/wysiwyg/files/drawing/61729.pdf>; CATEGORY: Connector; CONTACTS: 4; CURRENT_RATING: 1A; DESCRIPTION: CONN RCPT USB2.0 TYPEB 4POS R/A; GENDER: Receptacle; MANUFACTURER: Amphenol ICC (FCI); MOUNT_TYPE: R/A; MPN: 61729-1011BLF; OPERATING_TEMP: -55°C to 85°C; PART_STATUS: Active; ROHS_COMPLIANT: RoHS Compliant; SERIES: 61729; SUB-CATEGORY: USB; TYPE: USB-B
Y1 = 52101-101-REV-A_v16:CRYSTAL_NX5032GA: CRYSTAL; LCSC_PART: C115962